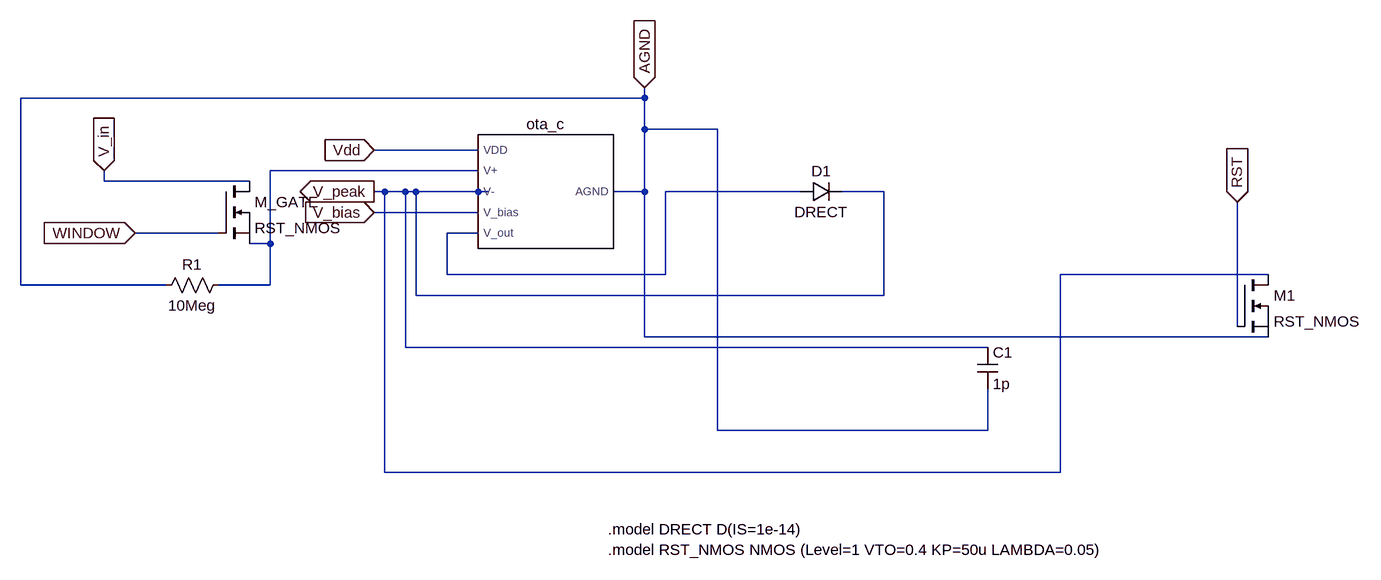
[diagram p0: schematic gated_peak.asc]
gated_peak.asc, the LTspice schematic file:
Version 4.1
SHEET 1 1388 708
WIRE 288 0 288 -16
WIRE 288 0 -672 0
WIRE 288 48 288 0
WIRE 400 48 288 48
WIRE 32 80 -128 80
WIRE 32 112 -288 112
WIRE -544 128 -544 112
WIRE -320 128 -544 128
WIRE -112 144 -128 144
WIRE -80 144 -112 144
WIRE -64 144 -80 144
WIRE 32 144 -64 144
WIRE 48 144 32 144
WIRE 288 144 288 48
WIRE 288 144 240 144
WIRE 528 144 320 144
WIRE 656 144 592 144
WIRE 32 176 -128 176
WIRE -368 208 -496 208
WIRE 32 208 -16 208
WIRE -288 224 -288 112
WIRE -288 224 -320 224
WIRE -16 272 -16 208
WIRE 320 272 320 144
WIRE 320 272 -16 272
WIRE 1248 272 928 272
WIRE -672 288 -672 0
WIRE -448 288 -672 288
WIRE -288 288 -288 224
WIRE -288 288 -368 288
WIRE -64 304 -64 144
WIRE 656 304 656 144
WIRE 656 304 -64 304
WIRE 1200 352 1200 160
WIRE 288 368 288 144
WIRE 1248 368 288 368
WIRE -80 384 -80 144
WIRE 816 384 -80 384
WIRE 400 512 400 48
WIRE 816 512 816 448
WIRE 816 512 400 512
WIRE -112 576 -112 144
WIRE 928 576 928 272
WIRE 928 576 -112 576
FLAG -128 80 Vdd
IOPIN -128 80 In
FLAG -128 144 V_peak
IOPIN -128 144 Out
FLAG -128 176 V_bias
IOPIN -128 176 In
FLAG 288 -16 AGND
IOPIN 288 -16 In
FLAG 1200 160 RST
IOPIN 1200 160 In
FLAG -544 112 V_in
IOPIN -544 112 In
FLAG -496 208 WINDOW
IOPIN -496 208 In
SYMBOL ota_core 128 144 R0
SYMATTR InstName ota_c
SYMBOL diode 528 160 R270
WINDOW 0 32 32 VTop 2
WINDOW 3 0 32 VBottom 2
SYMATTR InstName D1
SYMATTR Value DRECT
SYMBOL cap 800 384 R0
SYMATTR InstName C1
SYMATTR Value 1p
SYMBOL nmos 1200 272 R0
SYMATTR InstName M1
SYMATTR Value RST_NMOS
SYMBOL nmos -368 128 R0
SYMATTR InstName M_GATE
SYMATTR Value RST_NMOS
SYMBOL res -352 272 R90
WINDOW 0 0 56 VBottom 2
WINDOW 3 32 56 VTop 2
SYMATTR InstName R1
SYMATTR Value 10Meg
TEXT 232 664 Left 2 !.model DRECT D(IS=1e-14)\n.model RST_NMOS NMOS (Level=1 VTO=0.4 KP=50u LAMBDA=0.05)

The netlist it stands for:
* gated_peak.asc
X§ota_c Vdd N001 V_peak V_bias N002 AGND ota_core  ; pins VDD V+ V- V_bias V_out AGND
D1 N002 V_peak DRECT
C1 V_peak AGND 1p
M1 V_peak RST AGND AGND RST_NMOS
M_GATE V_in WINDOW N001 N001 RST_NMOS
R1 N001 AGND 10Meg
.model D D
.lib standard.dio
.model NMOS NMOS
.model PMOS PMOS
.lib standard.mos
.model DRECT D(IS=1e-14)
.model RST_NMOS NMOS (Level=1 VTO=0.4 KP=50u LAMBDA=0.05)
.backanno
.end